# Altium schematic sheet Sensor_module.SchDoc: Sensor_module
size A4; Date: 2018/10/8; Author: Wang Peirong; Revision: V1.1; SheetNumber: 4; Descripton: Encoder interface and bumper interface; pages: 6; Size: A4
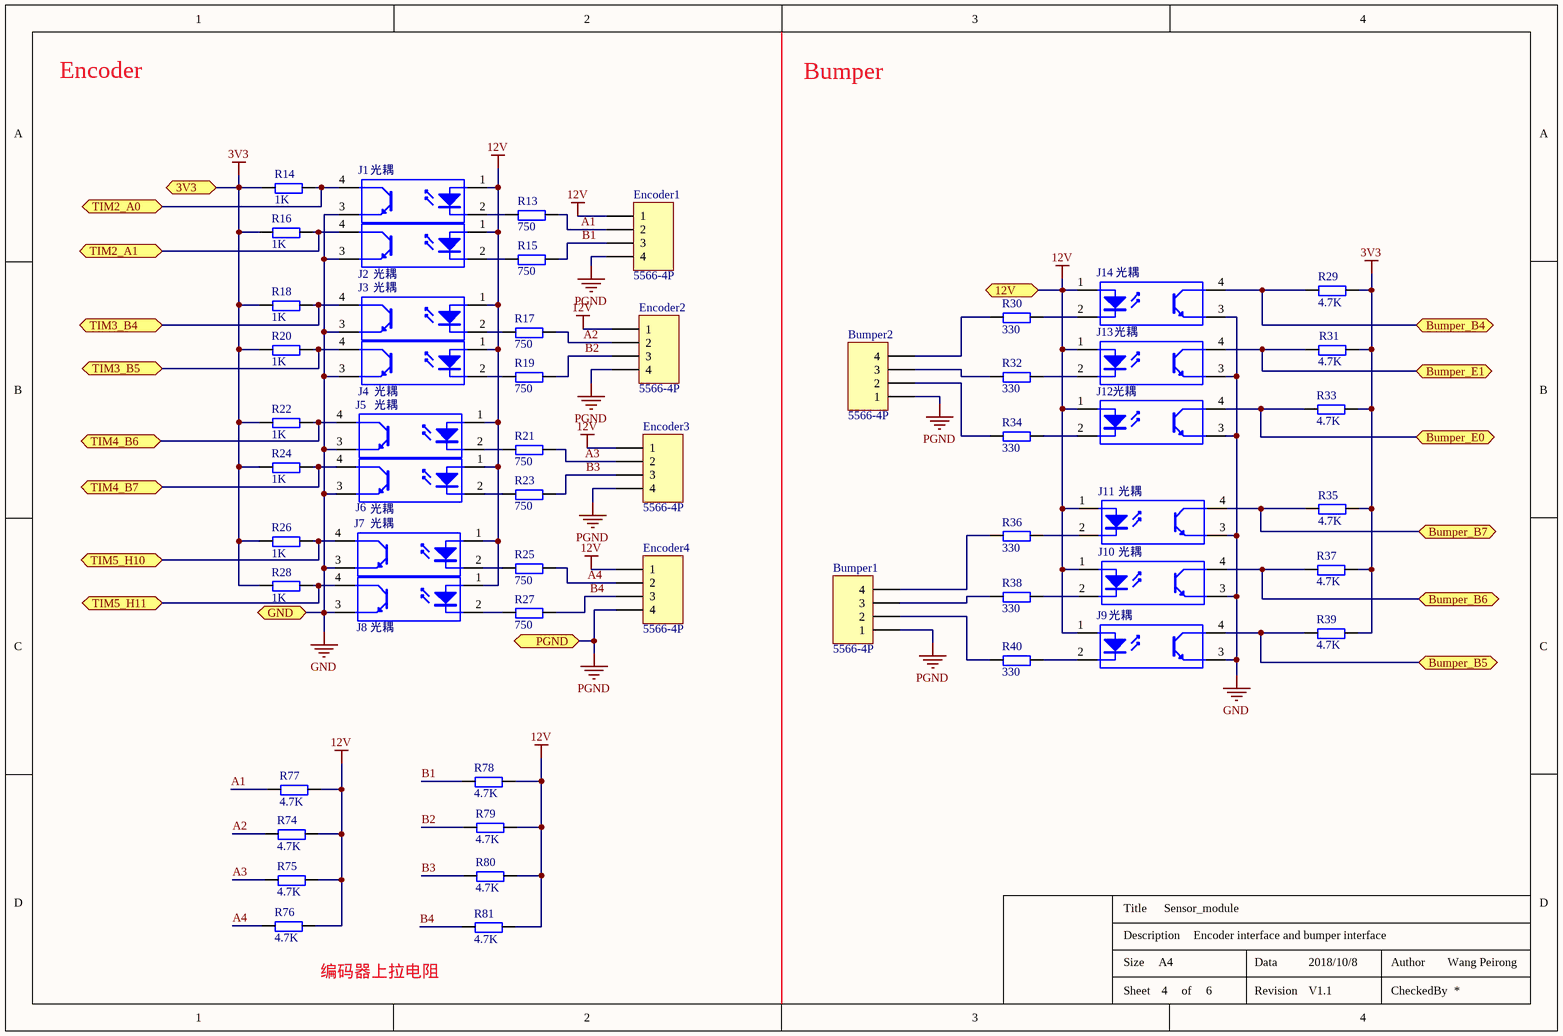
[diagram p0: Sensor_module.SchDoc]

## Parts
Bumper1  5566-4P  [5566-4P]
Bumper2  5566-4P  [5566-4P]
Encoder1  5566-4P  [5566-4P]
Encoder2  5566-4P  [5566-4P]
Encoder3  5566-4P  [5566-4P]
Encoder4  5566-4P  [5566-4P]
J1  光耦  [SOP127P710X350-4N]
J2  光耦  [SOP127P710X350-4N]
J3  光耦  [SOP127P710X350-4N]
J4  光耦  [SOP127P710X350-4N]
J5  光耦  [SOP127P710X350-4N]
J6  光耦  [SOP127P710X350-4N]
J7  光耦  [SOP127P710X350-4N]
J8  光耦  [SOP127P710X350-4N]
J9  光耦  [SOP127P710X350-4N]
J10  光耦  [SOP127P710X350-4N]
J11  光耦  [SOP127P710X350-4N]
J12  光耦  [SOP127P710X350-4N]
J13  光耦  [SOP127P710X350-4N]
J14  光耦  [SOP127P710X350-4N]
R13  750  [0603P]
R14  1K  [0603P]
R15  750  [0603P]
R16  1K  [0603P]
R17  750  [0603P]
R18  1K  [0603P]
R19  750  [0603P]
R20  1K  [0603P]
R21  750  [0603P]
R22  1K  [0603P]
R23  750  [0603P]
R24  1K  [0603P]
R25  750  [0603P]
R26  1K  [0603P]
R27  750  [0603P]
R28  1K  [0603P]
R29  4.7K  [0603P]
R30  330  [0603P]
R31  4.7K  [0603P]
R32  330  [0603P]
R33  4.7K  [0603P]
R34  330  [0603P]
R35  4.7K  [0603P]
R36  330  [0603P]
R37  4.7K  [0603P]
R38  330  [0603P]
R39  4.7K  [0603P]
R40  330  [0603P]
R74  4.7K  [0603P]
R75  4.7K  [0603P]
R76  4.7K  [0603P]
R77  4.7K  [0603P]
R78  4.7K  [0603P]
R79  4.7K  [0603P]
R80  4.7K  [0603P]
R81  4.7K  [0603P]

## Ports
3V3, 12V, Bumper_B4, Bumper_B5, Bumper_B6, Bumper_B7, Bumper_E0, Bumper_E1, GND, PGND, TIM2_A0, TIM2_A1, TIM3_B4, TIM3_B5, TIM4_B6, TIM4_B7, TIM5_H10, TIM5_H11

## Nets
3V3: R14.2 R16.2 R18.2 R20.2 R22.2 R24.2 R26.2 R28.2 R29.2 R31.2 R33.2 R35.2 R37.2 R39.2 ; port 3V3
12V: Encoder1.1 Encoder2.1 Encoder3.1 Encoder4.1 J1.1(A) J2.1(A) J3.1(A) J4.1(A) J5.1(A) J6.1(A) J7.1(A) J8.1(A) J9.1(A) J10.1(A) J11.1(A) J12.1(A) J13.1(A) J14.1(A) R74.2 R75.2 R76.2 R77.2 R78.2 R79.2 R80.2 R81.2 ; port 12V
GND: J1.3(E) J2.3(E) J3.3(E) J4.3(E) J5.3(E) J6.3(E) J7.3(E) J8.3(E) J9.3(E) J10.3(E) J11.3(E) J12.3(E) J13.3(E) J14.3(E) ; port GND
PGND: Bumper1.1 Bumper2.1 Encoder1.4 Encoder2.4 Encoder3.4 Encoder4.4 ; port PGND
A1: Encoder1.2 R13.1 R77.1
A2: Encoder2.2 R17.1 R74.1
A3: Encoder3.2 R21.1 R75.1
A4: Encoder4.2 R25.1 R76.1
B1: Encoder1.3 R15.1 R78.1
B2: Encoder2.3 R19.1 R79.1
B3: Encoder3.3 R23.1 R80.1
B4: Encoder4.3 R27.1 R81.1
Bumper_B4: J14.4(C) R29.1 ; port Bumper_B4
Bumper_B5: J9.4(C) R39.1 ; port Bumper_B5
Bumper_B6: J10.4(C) R37.1 ; port Bumper_B6
Bumper_B7: J11.4(C) R35.1 ; port Bumper_B7
Bumper_E0: J12.4(C) R33.1 ; port Bumper_E0
Bumper_E1: J13.4(C) R31.1 ; port Bumper_E1
TIM2_A0: J1.4(C) R14.1 ; port TIM2_A0
TIM2_A1: J2.4(C) R16.1 ; port TIM2_A1
TIM3_B4: J3.4(C) R18.1 ; port TIM3_B4
TIM3_B5: J4.4(C) R20.1 ; port TIM3_B5
TIM4_B6: J5.4(C) R22.1 ; port TIM4_B6
TIM4_B7: J6.4(C) R24.1 ; port TIM4_B7
TIM5_H10: J7.4(C) R26.1 ; port TIM5_H10
TIM5_H11: J8.4(C) R28.1 ; port TIM5_H11
NetBumper1_2: Bumper1.2 R40.1
NetBumper1_3: Bumper1.3 R38.1
NetBumper1_4: Bumper1.4 R36.1
NetBumper2_2: Bumper2.2 R34.1
NetBumper2_3: Bumper2.3 R32.1
NetBumper2_4: Bumper2.4 R30.1
NetJ1_2: J1.2(K) R13.2
NetJ2_2: J2.2(K) R15.2
NetJ3_2: J3.2(K) R17.2
NetJ4_2: J4.2(K) R19.2
NetJ5_2: J5.2(K) R21.2
NetJ6_2: J6.2(K) R23.2
NetJ7_2: J7.2(K) R25.2
NetJ8_2: J8.2(K) R27.2
NetJ9_2: J9.2(K) R40.2
NetJ10_2: J10.2(K) R38.2
NetJ11_2: J11.2(K) R36.2
NetJ12_2: J12.2(K) R34.2
NetJ13_2: J13.2(K) R32.2
NetJ14_2: J14.2(K) R30.2

## Notes on the sheet
- Encoder
- Bumper
- (near R76) 编码器上拉电阻
- Title
- Description
- Size
- Data
- Author
- Sheet
- of
- Revision
- CheckedBy

## Library data of the parts
Bumper1 Bumper2 Encoder1-Encoder4 = Header 4: Header, 4-Pin; LatestRevisionDate: 17-Jul-2002; LatestRevisionNote: Re-released for DXP Platform.; Publisher: Altium Limited
R13-R40 R74-R81 = R
J1-J14 = 光耦: Published: 24-Mar-1999; LatestRevisionDate: 04-Mar-2005; LatestRevisionNote: Sch pins 3 & 4 Swapped.; DatasheetDocument: Nov-2003; PackageReference: DIP-4; Publisher: Altium Limited